# Altium schematic sheet power.SchDoc
size A
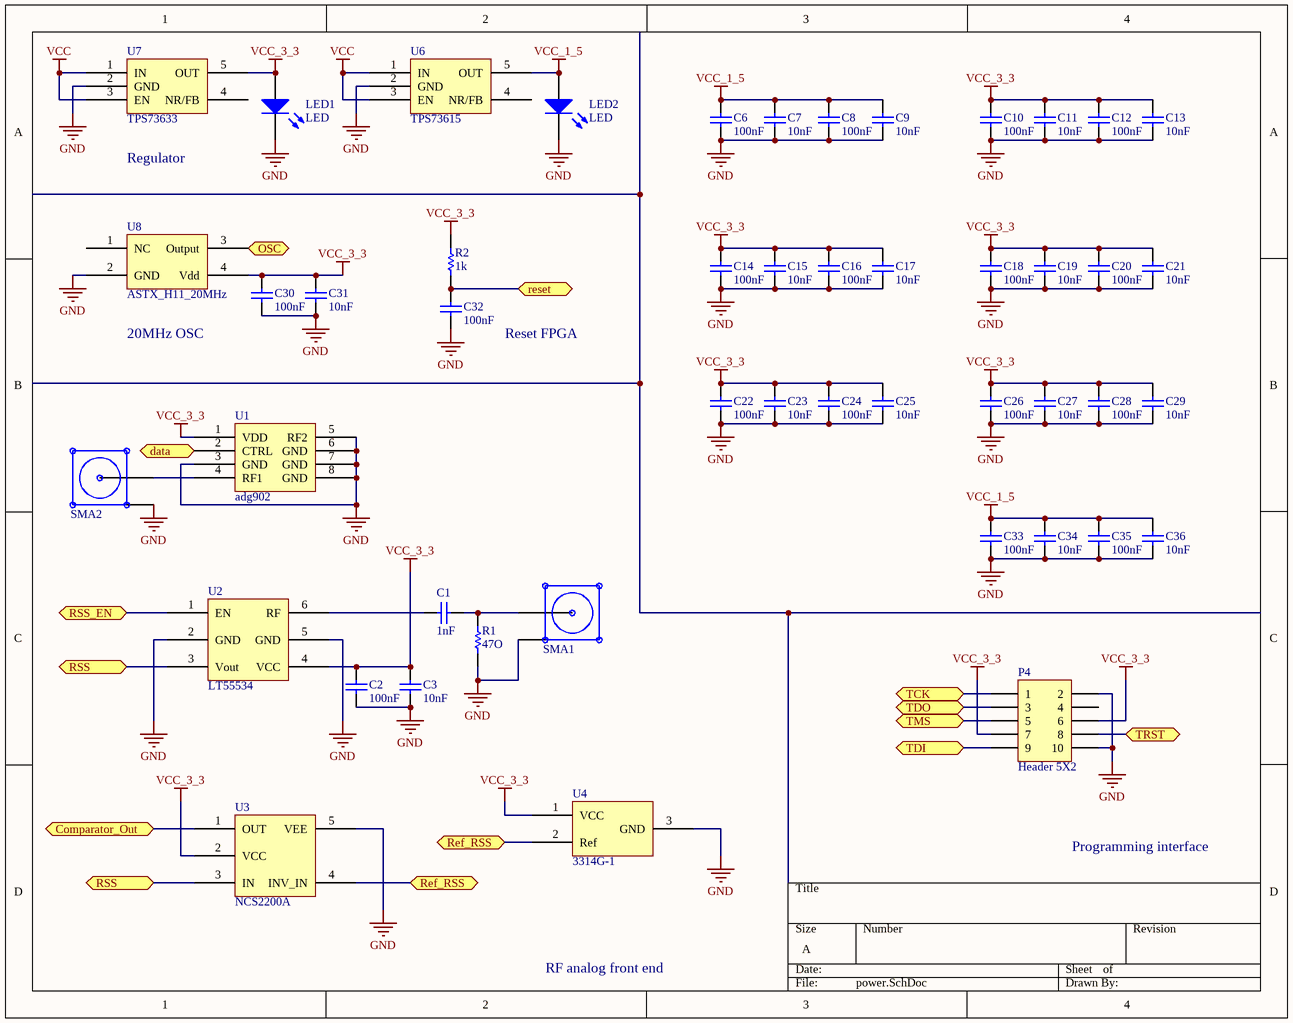
[diagram p0: power.SchDoc]

## Parts
C1  value 1nF  [0603]  (hidden comment: Cap)
C2  value 100nF  [0603]  (hidden comment: Cap)
C3  value 10nF  [0603]  (hidden comment: Cap)
C6  value 100nF  [0603]  (hidden comment: Cap)
C7  value 10nF  [0603]  (hidden comment: Cap)
C8  value 100nF  [0603]  (hidden comment: Cap)
C9  value 10nF  [0603]  (hidden comment: Cap)
C10  value 100nF  [0603]  (hidden comment: Cap)
C11  value 10nF  [0603]  (hidden comment: Cap)
C12  value 100nF  [0603]  (hidden comment: Cap)
C13  value 10nF  [0603]  (hidden comment: Cap)
C14  value 100nF  [0603]  (hidden comment: Cap)
C15  value 10nF  [0603]  (hidden comment: Cap)
C16  value 100nF  [0603]  (hidden comment: Cap)
C17  value 10nF  [0603]  (hidden comment: Cap)
C18  value 100nF  [0603]  (hidden comment: Cap)
C19  value 10nF  [0603]  (hidden comment: Cap)
C20  value 100nF  [0603]  (hidden comment: Cap)
C21  value 10nF  [0603]  (hidden comment: Cap)
C22  value 100nF  [0603]  (hidden comment: Cap)
C23  value 10nF  [0603]  (hidden comment: Cap)
C24  value 100nF  [0603]  (hidden comment: Cap)
C25  value 10nF  [0603]  (hidden comment: Cap)
C26  value 100nF  [0603]  (hidden comment: Cap)
C27  value 10nF  [0603]  (hidden comment: Cap)
C28  value 100nF  [0603]  (hidden comment: Cap)
C29  value 10nF  [0603]  (hidden comment: Cap)
C30  value 100nF  [0603]  (hidden comment: Cap)
C31  value 10nF  [0603]  (hidden comment: Cap)
C32  value 100nF  [0603]  (hidden comment: Cap)
C33  value 100nF  [0603]  (hidden comment: Cap)
C34  value 10nF  [0603]  (hidden comment: Cap)
C35  value 100nF  [0603]  (hidden comment: Cap)
C36  value 10nF  [0603]  (hidden comment: Cap)
LED1  LED  [0603]
LED2  LED  [0603]
P4  Header 5X2  [HDR2X5]
R1  value 47O  [0603]  (hidden comment: Res)
R2  value 1k  [0603]  (hidden comment: Res)
SMA1  SMA - Hole - 5 Pin  [SMA - Hole - 5 Pin]  (value not drawn)
SMA2  SMA - Hole - 5 Pin  [SMA - Hole - 5 Pin]  (value not drawn)
U1  adg902  [ADG902]
U2  LT55534  [LT5534]
U3  NCS2200A  [NCS2200]
U4  3314G-1  [3314G-1]
U6  TPS73615  [TPS73633]
U7  TPS73633  [TPS73633]
U8  ASTX_H11_20MHz  [ASTX_H11]

## Ports
Comparator_Out, data, OSC, Ref_RSS, reset, RSS, RSS_EN, TCK, TDI, TDO, TMS, TRST

## Nets
GND: C2.1 C3.1 C6.1 C7.1 C8.1 C9.1 C10.1 C11.1 C12.1 C13.1 C14.1 C15.1 C16.1 C17.1 C18.1 C19.1 C20.1 C21.1 C22.1 C23.1 C24.1 C25.1 C26.1 C27.1 C28.1 C29.1 C30.1 C31.1 C32.1 C33.1 C34.1 C35.1 C36.1 LED1.2(K) LED2.2(K) P4.2 P4.10 R1.1 SMA1.1 SMA2.1 U1.3(GND) U1.5(RF2) U1.6(GND) U1.7(GND) U1.8(GND) U2.2(GND) U2.5(GND) U3.5(VEE) U4.3(GND) U6.2(GND) U7.2(GND) U8.2(GND)
VCC: U6.1(IN) U6.3(EN) U7.1(IN) U7.3(EN)
VCC_1_5: C6.2 C7.2 C8.2 C9.2 C33.2 C34.2 C35.2 C36.2 LED2.1(A) U6.5(OUT)
VCC_3_3: C2.2 C3.2 C10.2 C11.2 C12.2 C13.2 C14.2 C15.2 C16.2 C17.2 C18.2 C19.2 C20.2 C21.2 C22.2 C23.2 C24.2 C25.2 C26.2 C27.2 C28.2 C29.2 C30.2 C31.2 LED1.1(A) P4.6 P4.7 R2.2 U1.1(VDD) U2.4(VCC) U3.2(VCC) U4.1(VCC) U7.5(OUT) U8.4(Vdd)
Comparator_Out: U3.1(OUT) ; port Comparator_Out
data: U1.2(CTRL) ; port data
OSC: U8.3(Output) ; port OSC
Ref_RSS: U3.4(INV_IN) U4.2(Ref) ; port Ref_RSS
reset: C32.2 R2.1 ; port reset
RSS: U2.3(Vout) U3.3(IN) ; port RSS
RSS_EN: U2.1(EN) ; port RSS_EN
TCK: P4.1 ; port TCK
TDI: P4.9 ; port TDI
TDO: P4.3 ; port TDO
TMS: P4.5 ; port TMS
TRST: P4.8 ; port TRST
NetC1_1: C1.1 U2.6(RF)
NetC1_2: C1.2 R1.2 SMA1.2
NetSMA2_2: SMA2.2 U1.4(RF1)

Not connected (* = marked no-connect by the designer): P4 4; U6 4(NR/FB); U7 4(NR/FB); U8 1(NC)

## Notes on the sheet
- Regulator
- 20MHz OSC
- Reset FPGA
- Programming interface
- RF analog front end

## Library data of the parts
C1-C3 C6-C36 = Cap: Ceramic Capacitor (Surface Mount); Manufacturer: Generic Ceramic Chip Cap (TBD); Digi-Key Part Number: *; Manufacturer Part Number: *; Note: *; Rating: *
P4 = Header 5X2: Header, 5-Pin, Dual row; LatestRevisionDate: 17-Jul-2002; LatestRevisionNote: Re-released for DXP Platform.; Publisher: Altium Limited
R1 R2 = Res: Chip Resistor (Surface Mount); Manufacturer: Generic Chip Res (TBD); Manufacturer Part Number: *; Digi-Key Part Number: *; Rating: *
SMA1 SMA2 = SMA - Hole - 5 Pin: SMA - Through Hole Connector; Manufacturer Part Number: *; Manufacturer: *; Digi-Key Part Number: *; Note: *